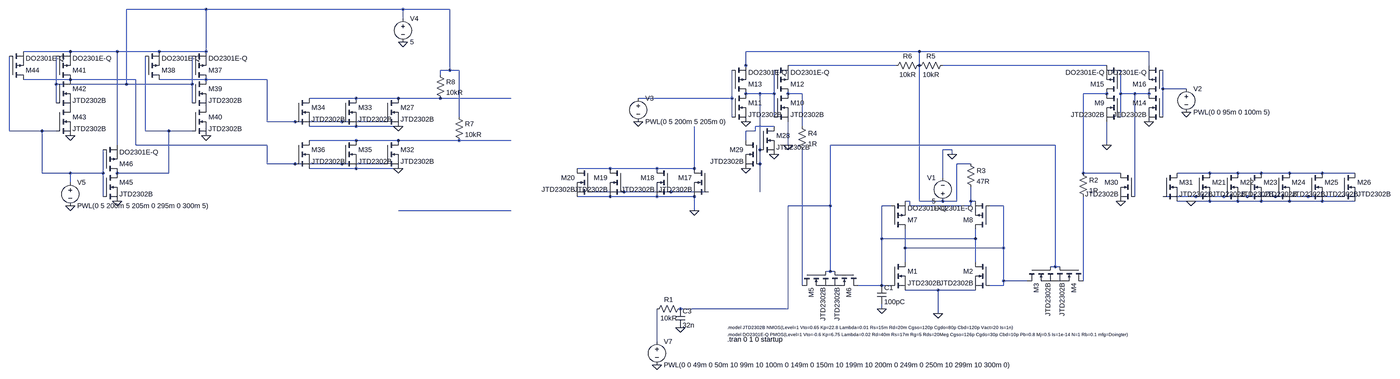
[diagram p0: schematic simulation.asc, whole sheet]
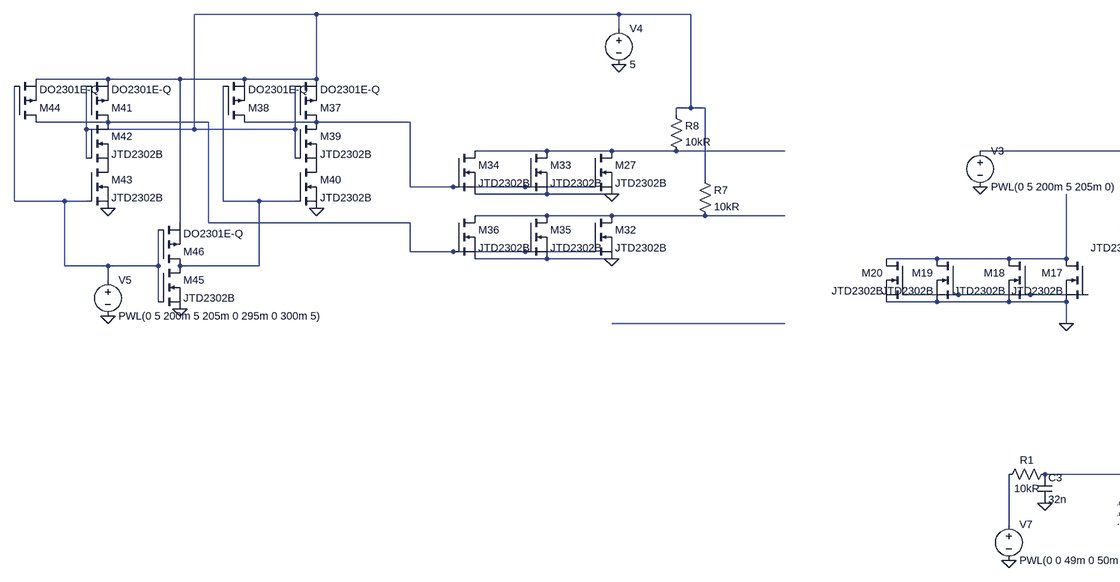
[diagram p1: schematic simulation.asc, part, row 1 of 1, column 1 of 2]
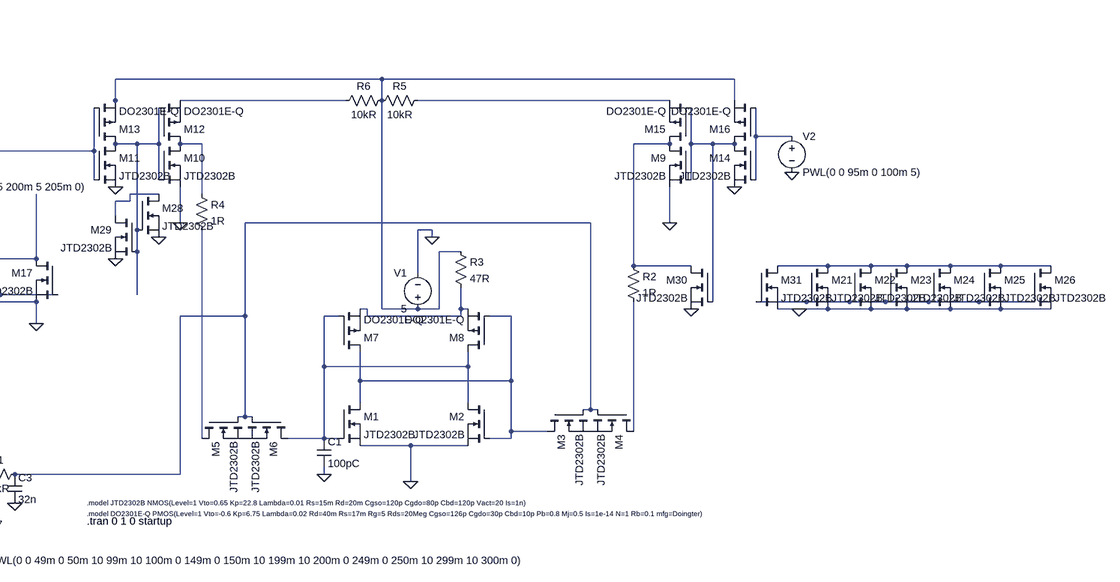
[diagram p2: schematic simulation.asc, part, row 1 of 1, column 2 of 2]
simulation.asc, the LTspice schematic file:
Version 4.1
SHEET 1 1856 680
WIRE -2752 -816 -3024 -816
WIRE -2080 -816 -2752 -816
WIRE -1920 -816 -2080 -816
WIRE -2080 -784 -2080 -816
WIRE -3216 -672 -3376 -672
WIRE -3056 -672 -3216 -672
WIRE -2912 -672 -3056 -672
WIRE -2752 -672 -2752 -816
WIRE -2752 -672 -2912 -672
WIRE 240 -672 -352 -672
WIRE 1024 -672 240 -672
WIRE -352 -624 -352 -672
WIRE 160 -624 -208 -624
WIRE 240 -624 240 -672
WIRE 880 -624 320 -624
WIRE 1024 -624 1024 -672
WIRE -1920 -608 -1920 -816
WIRE -1920 -608 -1952 -608
WIRE -1888 -608 -1920 -608
WIRE -352 -608 -352 -624
WIRE -1952 -592 -1952 -608
WIRE -3216 -576 -3376 -576
WIRE -2992 -576 -3216 -576
WIRE -2752 -576 -2912 -576
WIRE -2544 -576 -2752 -576
WIRE -3264 -560 -3264 -656
WIRE -3024 -560 -3024 -816
WIRE -3024 -560 -3264 -560
WIRE -2800 -560 -2800 -656
WIRE -2800 -560 -3024 -560
WIRE 1072 -544 1072 -608
WIRE 1152 -544 1072 -544
WIRE -304 -528 -352 -528
WIRE -256 -528 -256 -608
WIRE -256 -528 -304 -528
WIRE -160 -528 -208 -528
WIRE 880 -528 800 -528
WIRE 928 -528 928 -608
WIRE 976 -528 928 -528
WIRE 1024 -528 976 -528
WIRE -2240 -512 -2400 -512
WIRE -2096 -512 -2240 -512
WIRE -1952 -512 -2096 -512
WIRE -1696 -512 -1952 -512
WIRE -400 -512 -400 -608
WIRE -400 -512 -720 -512
WIRE -3264 -496 -3264 -560
WIRE -2800 -496 -2800 -560
WIRE -1888 -448 -1888 -608
WIRE -400 -448 -400 -512
WIRE -256 -448 -256 -528
WIRE 928 -448 928 -528
WIRE 1072 -448 1072 -544
WIRE -2544 -432 -2544 -576
WIRE -2448 -432 -2544 -432
WIRE -2288 -432 -2448 -432
WIRE -2144 -432 -2288 -432
WIRE -2240 -416 -2400 -416
WIRE -2096 -416 -2240 -416
WIRE -256 -416 -320 -416
WIRE -160 -416 -160 -528
WIRE -3424 -400 -3424 -656
WIRE -3312 -400 -3424 -400
WIRE -3264 -400 -3312 -400
WIRE -2960 -400 -2960 -656
WIRE -2880 -400 -2960 -400
WIRE -2800 -400 -2880 -400
WIRE -320 -400 -320 -416
WIRE -320 -400 -352 -400
WIRE -2240 -368 -2400 -368
WIRE -2096 -368 -2240 -368
WIRE -1888 -368 -2096 -368
WIRE -1696 -368 -1888 -368
WIRE -352 -368 -352 -400
WIRE -3056 -352 -3056 -672
WIRE -2992 -352 -2992 -576
WIRE -2544 -352 -2992 -352
WIRE -208 -352 -208 -432
WIRE 704 -352 -64 -352
WIRE 880 -352 880 -432
WIRE -304 -336 -304 -528
WIRE 352 -336 320 -336
WIRE 352 -320 352 -336
WIRE -2544 -288 -2544 -352
WIRE -2448 -288 -2544 -288
WIRE -2288 -288 -2448 -288
WIRE -2144 -288 -2288 -288
WIRE -304 -288 -304 -336
WIRE 416 -288 368 -288
WIRE -2240 -272 -2400 -272
WIRE -2096 -272 -2240 -272
WIRE -816 -272 -928 -272
WIRE -656 -272 -816 -272
WIRE -528 -272 -528 -416
WIRE -528 -272 -656 -272
WIRE -3312 -256 -3312 -400
WIRE -3216 -256 -3312 -256
WIRE -3104 -256 -3104 -336
WIRE -3104 -256 -3216 -256
WIRE -2880 -256 -2880 -400
WIRE -2880 -256 -3056 -256
WIRE 800 -256 800 -528
WIRE 928 -256 800 -256
WIRE 1232 -256 1120 -256
WIRE 1328 -256 1232 -256
WIRE 1408 -256 1328 -256
WIRE 1504 -256 1408 -256
WIRE 1616 -256 1504 -256
WIRE 1728 -256 1616 -256
WIRE 320 -240 320 -336
WIRE -3216 -224 -3216 -256
WIRE -768 -192 -880 -192
WIRE -608 -192 -768 -192
WIRE -480 -192 -608 -192
WIRE -304 -192 -304 -288
WIRE -3104 -176 -3104 -256
WIRE -816 -176 -928 -176
WIRE -656 -176 -816 -176
WIRE -528 -176 -656 -176
WIRE 976 -176 976 -528
WIRE 1184 -176 1072 -176
WIRE 1280 -176 1184 -176
WIRE 1360 -176 1280 -176
WIRE 1456 -176 1360 -176
WIRE 1568 -176 1456 -176
WIRE 1680 -176 1568 -176
WIRE 208 -160 192 -160
WIRE 240 -160 240 -624
WIRE 320 -160 240 -160
WIRE 368 -160 368 -288
WIRE 368 -160 320 -160
WIRE 416 -160 416 -208
WIRE 432 -160 416 -160
WIRE 1168 -160 1120 -160
WIRE 1232 -160 1168 -160
WIRE 1328 -160 1232 -160
WIRE 1408 -160 1328 -160
WIRE 1504 -160 1408 -160
WIRE 1616 -160 1504 -160
WIRE 1728 -160 1616 -160
WIRE -64 -144 -64 -352
WIRE -64 -144 -208 -144
WIRE 144 -144 112 -144
WIRE 208 -144 208 -160
WIRE 416 -144 416 -160
WIRE 416 -144 208 -144
WIRE 528 -144 480 -144
WIRE -1696 -128 -2096 -128
WIRE -528 -128 -528 -176
WIRE 112 -32 112 -144
WIRE 432 -32 432 -64
WIRE 432 -32 112 -32
WIRE 192 0 192 -64
WIRE 528 0 528 -144
WIRE 528 0 192 0
WIRE 192 48 192 0
WIRE 432 48 432 -32
WIRE 704 64 704 -352
WIRE 704 64 688 64
WIRE 720 64 704 64
WIRE -64 80 -64 -144
WIRE -64 80 -80 80
WIRE -48 80 -64 80
WIRE 528 112 528 0
WIRE 608 112 528 112
WIRE 800 112 800 -176
WIRE -160 128 -160 -336
WIRE 112 128 112 -32
WIRE 112 128 32 128
WIRE 144 128 112 128
WIRE 528 128 528 112
WIRE 528 128 480 128
WIRE 304 144 192 144
WIRE 432 144 304 144
WIRE -208 208 -208 -144
WIRE -208 208 -576 208
WIRE 112 208 112 192
WIRE 304 224 304 144
WIRE -656 320 -656 208
FLAG 304 224 0
FLAG -720 -432 0
FLAG 1152 -464 0
FLAG 1024 -432 0
FLAG -352 -432 0
FLAG 880 -352 0
FLAG -208 -352 0
FLAG -656 400 0
FLAG 112 208 0
FLAG -256 -320 0
FLAG 928 -160 0
FLAG -576 272 0
FLAG -528 -128 0
FLAG 1168 -160 0
FLAG -352 -272 0
FLAG 352 -320 0
FLAG -2080 -704 0
FLAG -2096 -416 0
FLAG -2096 -272 0
FLAG -2752 -384 0
FLAG -3216 -384 0
FLAG -3056 -160 0
FLAG -3216 -144 0
SYMBOL nmos 144 48 R0
SYMATTR InstName M1
SYMATTR Value JTD2302B
SYMBOL nmos 480 48 M0
SYMATTR InstName M2
SYMATTR Value JTD2302B
SYMBOL nmos 608 64 M90
SYMATTR InstName M3
SYMATTR Value JTD2302B
SYMBOL nmos 800 64 R90
SYMATTR InstName M4
SYMATTR Value JTD2302B
SYMBOL nmos -160 80 M90
SYMATTR InstName M5
SYMATTR Value JTD2302B
SYMBOL nmos 32 80 R90
SYMATTR InstName M6
SYMATTR Value JTD2302B
SYMBOL pmos 144 -64 M180
SYMATTR InstName M7
SYMATTR Value DO2301E-Q
SYMBOL pmos 480 -64 R180
SYMATTR InstName M8
SYMATTR Value DO2301E-Q
SYMBOL voltage 320 -144 R180
WINDOW 0 24 96 Left 2
WINDOW 3 24 16 Left 2
WINDOW 123 0 0 Left 0
WINDOW 39 0 0 Left 0
SYMATTR InstName V1
SYMATTR Value 5
SYMBOL voltage 1152 -560 R0
WINDOW 123 0 0 Left 0
WINDOW 39 0 0 Left 0
SYMATTR InstName V2
SYMATTR Value PWL(0 0 95m 0 100m 5)
SYMBOL voltage -720 -528 R0
WINDOW 123 0 0 Left 0
WINDOW 39 0 0 Left 0
SYMATTR InstName V3
SYMATTR Value PWL(0 5 200m 5 205m 0)
SYMBOL nmos 928 -528 M0
SYMATTR InstName M9
SYMATTR Value JTD2302B
SYMBOL nmos -256 -528 R0
SYMATTR InstName M10
SYMATTR Value JTD2302B
SYMBOL nmos -400 -528 R0
SYMATTR InstName M11
SYMATTR Value JTD2302B
SYMBOL pmos -256 -528 M180
SYMATTR InstName M12
SYMATTR Value DO2301E-Q
SYMBOL pmos -400 -528 M180
SYMATTR InstName M13
SYMATTR Value DO2301E-Q
SYMBOL nmos 1072 -528 M0
SYMATTR InstName M14
SYMATTR Value JTD2302B
SYMBOL pmos 928 -528 R180
SYMATTR InstName M15
SYMATTR Value DO2301E-Q
SYMBOL pmos 1072 -528 R180
SYMATTR InstName M16
SYMATTR Value DO2301E-Q
SYMBOL res 336 -640 R90
WINDOW 0 0 56 VBottom 2
WINDOW 3 32 56 VTop 2
SYMATTR InstName R5
SYMATTR Value 10kR
SYMBOL res 256 -640 R90
WINDOW 0 0 56 VBottom 2
WINDOW 3 32 56 VTop 2
SYMATTR InstName R6
SYMATTR Value 10kR
SYMBOL voltage -656 304 R0
WINDOW 123 0 0 Left 0
WINDOW 39 24 124 Left 2
SYMATTR InstName V7
SYMATTR Value PWL(0 0 49m 0 50m 10 99m 10 100m 0 149m 0 150m 10 199m 10 200m 0 249m 0 250m 10 299m 10 300m 0)
SYMBOL nmos -304 -416 R0
SYMATTR InstName M28
SYMATTR Value JTD2302B
SYMBOL nmos -304 -368 M0
SYMATTR InstName M29
SYMATTR Value JTD2302B
SYMBOL nmos 976 -256 M0
SYMATTR InstName M30
SYMATTR Value JTD2302B
SYMBOL nmos 1072 -256 R0
SYMATTR InstName M31
SYMATTR Value JTD2302B
SYMBOL res -560 192 R90
WINDOW 0 0 56 VBottom 2
WINDOW 3 32 56 VTop 2
SYMATTR InstName R1
SYMATTR Value 10kR
SYMBOL cap -592 208 R0
SYMATTR InstName C3
SYMATTR Value 32n
SYMBOL cap 96 128 R0
SYMATTR InstName C1
SYMATTR Value 100pC
SYMBOL res 784 -272 R0
SYMATTR InstName R2
SYMATTR Value 1R
SYMBOL res -176 -432 R0
SYMATTR InstName R4
SYMATTR Value 1R
SYMBOL nmos -480 -272 M0
SYMATTR InstName M17
SYMATTR Value JTD2302B
SYMBOL nmos -608 -272 M0
SYMATTR InstName M18
SYMATTR Value JTD2302B
SYMBOL nmos -768 -272 M0
SYMATTR InstName M19
SYMATTR Value JTD2302B
SYMBOL nmos -880 -272 M0
SYMATTR InstName M20
SYMATTR Value JTD2302B
SYMBOL nmos 1184 -256 R0
SYMATTR InstName M21
SYMATTR Value JTD2302B
SYMBOL nmos 1280 -256 R0
SYMATTR InstName M22
SYMATTR Value JTD2302B
SYMBOL nmos 1360 -256 R0
SYMATTR InstName M23
SYMATTR Value JTD2302B
SYMBOL nmos 1456 -256 R0
SYMATTR InstName M24
SYMATTR Value JTD2302B
SYMBOL nmos 1568 -256 R0
SYMATTR InstName M25
SYMATTR Value JTD2302B
SYMBOL nmos 1680 -256 R0
SYMATTR InstName M26
SYMATTR Value JTD2302B
SYMBOL res 400 -304 R0
SYMATTR InstName R3
SYMATTR Value 47R
SYMBOL res -1904 -464 R0
SYMATTR InstName R7
SYMATTR Value 10kR
SYMBOL res -1968 -608 R0
SYMATTR InstName R8
SYMATTR Value 10kR
SYMBOL voltage -2080 -800 R0
WINDOW 123 0 0 Left 0
WINDOW 39 0 0 Left 0
SYMATTR InstName V4
SYMATTR Value 5
SYMBOL nmos -2144 -512 R0
SYMATTR InstName M27
SYMATTR Value JTD2302B
SYMBOL nmos -2144 -368 R0
SYMATTR InstName M32
SYMATTR Value JTD2302B
SYMBOL nmos -2288 -512 R0
SYMATTR InstName M33
SYMATTR Value JTD2302B
SYMBOL nmos -2448 -512 R0
SYMATTR InstName M34
SYMATTR Value JTD2302B
SYMBOL nmos -2288 -368 R0
SYMATTR InstName M35
SYMATTR Value JTD2302B
SYMBOL nmos -2448 -368 R0
SYMATTR InstName M36
SYMATTR Value JTD2302B
SYMBOL pmos -2800 -576 M180
SYMATTR InstName M37
SYMATTR Value DO2301E-Q
SYMBOL nmos -2800 -576 R0
SYMATTR InstName M39
SYMATTR Value JTD2302B
SYMBOL nmos -2800 -480 R0
SYMATTR InstName M40
SYMATTR Value JTD2302B
SYMBOL pmos -2960 -576 M180
SYMATTR InstName M38
SYMATTR Value DO2301E-Q
SYMBOL pmos -3264 -576 M180
SYMATTR InstName M41
SYMATTR Value DO2301E-Q
SYMBOL nmos -3264 -576 R0
SYMATTR InstName M42
SYMATTR Value JTD2302B
SYMBOL nmos -3264 -480 R0
SYMATTR InstName M43
SYMATTR Value JTD2302B
SYMBOL pmos -3424 -576 M180
SYMATTR InstName M44
SYMATTR Value DO2301E-Q
SYMBOL nmos -3104 -256 R0
SYMATTR InstName M45
SYMATTR Value JTD2302B
SYMBOL pmos -3104 -256 M180
SYMATTR InstName M46
SYMATTR Value DO2301E-Q
SYMBOL voltage -3216 -240 R0
WINDOW 123 0 0 Left 0
WINDOW 39 0 0 Left 0
SYMATTR InstName V5
SYMATTR Value PWL(0 5 200m 5 205m 0 295m 0 300m 5)
TEXT -416 272 Left 1 !.model JTD2302B NMOS(Level=1 Vto=0.65 Kp=22.8 Lambda=0.01 Rs=15m Rd=20m Cgso=120p Cgdo=80p Cbd=120p Vact=20 Is=1n)
TEXT -416 296 Left 1 !.model DO2301E-Q PMOS(Level=1 Vto=-0.6 Kp=6.75 Lambda=0.02 Rd=40m Rs=17m Rg=5 Rds=20Meg Cgso=126p Cgdo=30p Cbd=10p Pb=0.8 Mj=0.5 Is=1e-14 N=1 Rb=0.1 mfg=Doingter)
TEXT -416 312 Left 2 !.tran 0 1 0 startup

The netlist it stands for:
* simulation.asc
M1 N025 N024 0 0 JTD2302B
M2 N024 N025 0 0 JTD2302B
M3 N025 N018 P001 P001 JTD2302B
M4 N027 N018 P001 P001 JTD2302B
M5 N028 N018 P002 P002 JTD2302B
M6 N024 N018 P002 P002 JTD2302B
M7 N025 N024 N023 N023 DO2301E-Q
M8 N024 N025 N023 N023 DO2301E-Q
V1 N002 0 5
V2 N007 0 PWL(0 0 95m 0 100m 5)
V3 N013 0 PWL(0 5 200m 5 205m 0)
M9 N010 N011 0 0 JTD2302B
M10 N009 N008 0 0 JTD2302B
M11 N008 N013 0 0 JTD2302B
M12 N009 N008 N003 N003 DO2301E-Q
M13 N008 N013 N002 N002 DO2301E-Q
M14 N011 N007 0 0 JTD2302B
M15 N010 N011 N004 N004 DO2301E-Q
M16 N011 N007 N002 N002 DO2301E-Q
R5 N004 N002 10kR
R6 N002 N003 10kR
V7 N029 0 PWL(0 0 49m 0 50m 10 99m 10 100m 0 149m 0 150m 10 199m 10 200m 0 249m 0 250m 10 299m 10 300m 0)
M28 N014 N008 0 0 JTD2302B
M29 N014 N008 0 0 JTD2302B
M30 N010 N011 0 0 JTD2302B
M31 N020 N022 0 0 JTD2302B
R1 N018 N029 10kR
C3 N018 0 32n
C1 N024 0 100pC
R2 N010 N027 1R
R4 N009 N028 1R
M17 N019 N021 0 0 JTD2302B
M18 N019 N021 0 0 JTD2302B
M19 N019 N021 0 0 JTD2302B
M20 N019 N021 0 0 JTD2302B
M21 N020 N022 0 0 JTD2302B
M22 N020 N022 0 0 JTD2302B
M23 N020 N022 0 0 JTD2302B
M24 N020 N022 0 0 JTD2302B
M25 N020 N022 0 0 JTD2302B
M26 N020 N022 0 0 JTD2302B
R3 N002 N023 47R
R7 N001 N017 10kR
R8 N001 N012 10kR
V4 N001 0 5
M27 N012 N006 0 0 JTD2302B
M32 N017 N005 0 0 JTD2302B
M33 N012 N006 0 0 JTD2302B
M34 N012 N006 0 0 JTD2302B
M35 N017 N005 0 0 JTD2302B
M36 N017 N005 0 0 JTD2302B
M37 N006 N001 N001 N001 DO2301E-Q
M39 N006 N001 P003 P003 JTD2302B
M40 P003 N016 0 0 JTD2302B
M38 N006 N016 N001 N001 DO2301E-Q
M41 N005 N001 N001 N001 DO2301E-Q
M42 N005 N001 P004 P004 JTD2302B
M43 P004 N015 0 0 JTD2302B
M44 N005 N015 N001 N001 DO2301E-Q
M45 N016 N015 0 0 JTD2302B
M46 N016 N015 N001 N001 DO2301E-Q
V5 N015 0 PWL(0 5 200m 5 205m 0 295m 0 300m 5)
.model NMOS NMOS
.model PMOS PMOS
.lib standard.mos
.model JTD2302B NMOS(Level=1 Vto=0.65 Kp=22.8 Lambda=0.01 Rs=15m Rd=20m Cgso=120p Cgdo=80p Cbd=120p Vact=20 Is=1n)
.model DO2301E-Q PMOS(Level=1 Vto=-0.6 Kp=6.75 Lambda=0.02 Rd=40m Rs=17m Rg=5 Rds=20Meg Cgso=126p Cgdo=30p Cbd=10p Pb=0.8 Mj=0.5 Is=1e-14 N=1 Rb=0.1 mfg=Doingter)
.tran 0 1 0 startup
.backanno
.end